# Altium schematic sheet LM3350 IC.SchDoc
size A4
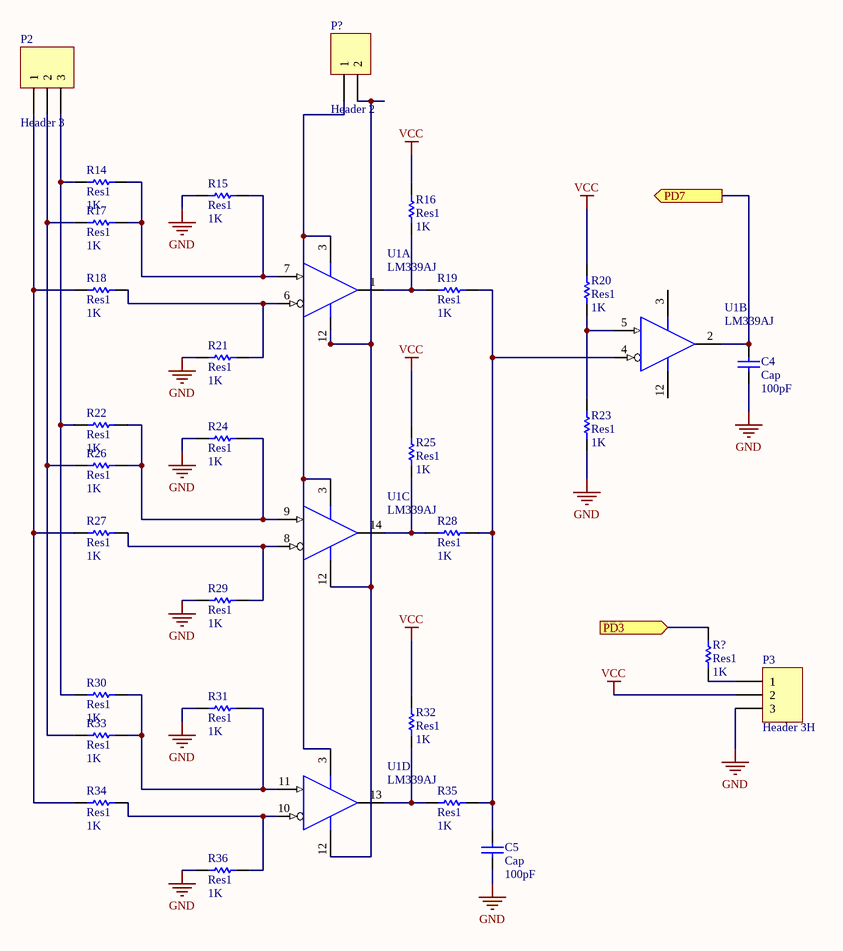
[diagram p0: LM3350 IC.SchDoc]

## Parts
C4  Cap  value 100pF  [RAD-0.3]
C5  Cap  value 100pF  [RAD-0.3]
P2  Header 3  [HDR1X3]
P3  Header 3H  [HDR1X3H]
P?  Header 2  [HDR1X2]
R14  Res1  value 1K  [AXIAL-0.3]
R15  Res1  value 1K  [AXIAL-0.3]
R16  Res1  value 1K  [AXIAL-0.3]
R17  Res1  value 1K  [AXIAL-0.3]
R18  Res1  value 1K  [AXIAL-0.3]
R19  Res1  value 1K  [AXIAL-0.3]
R20  Res1  value 1K  [AXIAL-0.3]
R21  Res1  value 1K  [AXIAL-0.3]
R22  Res1  value 1K  [AXIAL-0.3]
R23  Res1  value 1K  [AXIAL-0.3]
R24  Res1  value 1K  [AXIAL-0.3]
R25  Res1  value 1K  [AXIAL-0.3]
R26  Res1  value 1K  [AXIAL-0.3]
R27  Res1  value 1K  [AXIAL-0.3]
R28  Res1  value 1K  [AXIAL-0.3]
R29  Res1  value 1K  [AXIAL-0.3]
R30  Res1  value 1K  [AXIAL-0.3]
R31  Res1  value 1K  [AXIAL-0.3]
R32  Res1  value 1K  [AXIAL-0.3]
R33  Res1  value 1K  [AXIAL-0.3]
R34  Res1  value 1K  [AXIAL-0.3]
R35  Res1  value 1K  [AXIAL-0.3]
R36  Res1  value 1K  [AXIAL-0.3]
R?  Res1  value 1K  [AXIAL-0.3]
U1  LM339AJ  [J014]  (parts A,B,C,D of 4)

## Ports
PD3 (in), PD7 (out)

## Nets
GND: C4.1 C5.1 P3.3 R15.1 R21.1 R23.1 R24.1 R29.1 R31.1 R36.1
VCC: P3.2 R16.2 R20.2 R25.2 R32.2
PD3: R?.2 ; port PD3
PD7: C4.2 U1.2(OUT) ; port PD7
NetC5_2: C5.2 R19.2 R28.2 R35.2 U1.4(IN-)
NetP2_1: P2.1 R18.1 R27.1 R34.1
NetP2_2: P2.2 R17.1 R26.1 R33.1
NetP2_3: P2.3 R14.1 R22.1 R30.1
NetP3_1: P3.1 R?.1
NetP?_1: P?.1 U1.3(VCC)
NetP?_2: P?.2 U1.12(GND)
NetR14_2: R14.2 R15.2 R17.2 U1.7(IN+)
NetR16_1: R16.1 R19.1 U1.1(OUT)
NetR18_2: R18.2 R21.2 U1.6(IN-)
NetR20_1: R20.1 R23.2 U1.5(IN+)
NetR22_2: R22.2 R24.2 R26.2 U1.9(IN+)
NetR25_1: R25.1 R28.1 U1.14(OUT)
NetR27_2: R27.2 R29.2 U1.8(IN-)
NetR30_2: R30.2 R31.2 R33.2 U1.11(IN+)
NetR32_1: R32.1 R35.1 U1.13(OUT)
NetR34_2: R34.2 R36.2 U1.10(IN-)

## Library data of the parts
C4 C5 = Cap: Capacitor; Published: 8-Jun-2000; LatestRevisionDate: 17-Jul-2002; LatestRevisionNote: Re-released for DXP Platform.; PackageReference: RAD-0.3; Publisher: Altium Limited; PackageDescription: Radial Cap, Thru-Hole; 2 Leads; 0.3 in Pin Spacing
P2 = Header 3: Header, 3-Pin; LatestRevisionDate: 17-Jul-2002; LatestRevisionNote: Re-released for DXP Platform.; Publisher: Altium Limited
P3 = Header 3H: Header, 3-Pin, Right Angle; LatestRevisionDate: 17-Jul-2002; LatestRevisionNote: Re-released for DXP Platform.; Publisher: Altium Limited
P? = Header 2: Header, 2-Pin; LatestRevisionDate: 17-Jul-2002; LatestRevisionNote: Re-released for DXP Platform.; Publisher: Altium Limited
R14-R36 R? = Res1: Resistor; Published: 8-Jun-2000; LatestRevisionDate: 17-Jul-2002; LatestRevisionNote: Re-released for DXP Platform.; PackageReference: AXIAL-0.3; Publisher: Altium Limited; PackageDescription: Axial Device, Thru-Hole; 2 Leads; 0.3 in Pin Spacing
U1 = LM339AJ: Quad Differential Comparator; Published: 15-Apr-2002; LatestRevisionDate: 04-Mar-2005; LatestRevisionNote: Stylized 3D Model Added.; DatasheetVersion: Apr-1988; PackageVersion: Jun-1999; PackageReference: J014; Publisher: Altium Limited; PackageDescription: DIP; 14 Leads; Row Spacing 7.62 mm; Pitch 2.54 mm; ComponentLink1Description: Manufacturer Link; ComponentLink1URL: http://www.ti.com/; ComponentLink2Description: Datasheet; ComponentLink2URL: http://www-s.ti.com/sc/ds/lm139a.pdf